# Altium project latticeDevBoard.PrjPcb
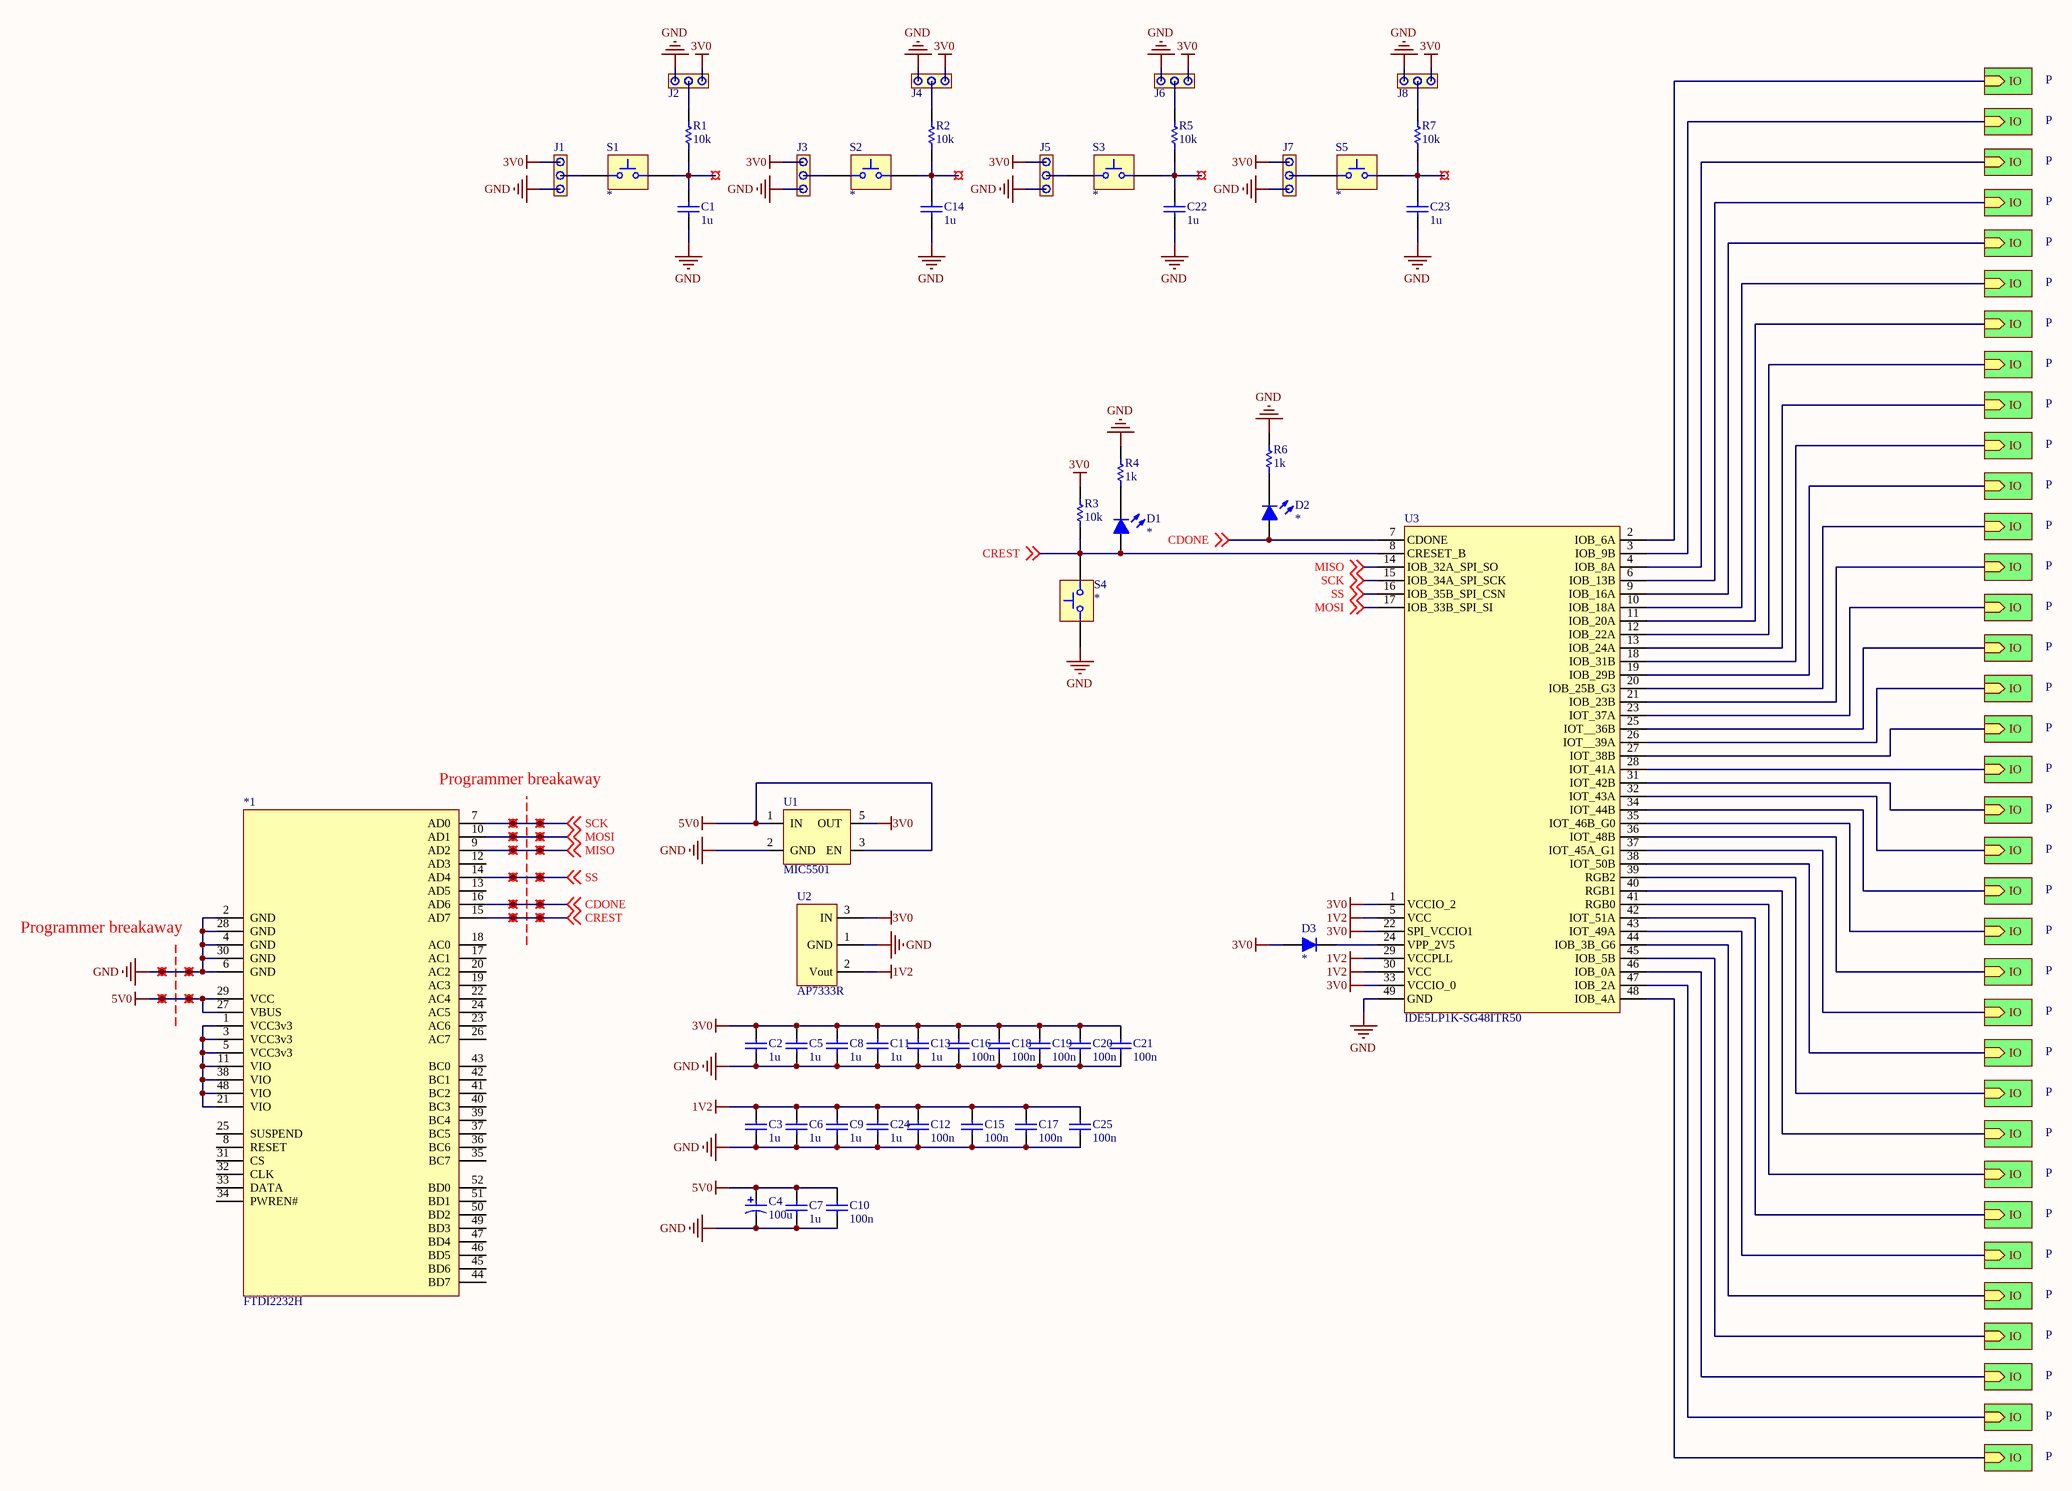
[diagram p0: Sheet1.SchDoc]
2 sheets, 283 parts. Net scope: hierarchical (ports join the sheet entries above them; power ports are global).
Board file: PCB1.PcbDoc
Sheets:
  Sheet1.SchDoc
    P = IOpin.SchDoc
    P = IOpin.SchDoc
    P = IOpin.SchDoc
    P = IOpin.SchDoc
    P = IOpin.SchDoc
    P = IOpin.SchDoc
    P = IOpin.SchDoc
    P = IOpin.SchDoc
    P = IOpin.SchDoc
    P = IOpin.SchDoc
    P = IOpin.SchDoc
    P = IOpin.SchDoc
    P = IOpin.SchDoc
    P = IOpin.SchDoc
    P = IOpin.SchDoc
    P = IOpin.SchDoc
    P = IOpin.SchDoc
    P = IOpin.SchDoc
    P = IOpin.SchDoc
    P = IOpin.SchDoc
    P = IOpin.SchDoc
    P = IOpin.SchDoc
    P = IOpin.SchDoc
    P = IOpin.SchDoc
    P = IOpin.SchDoc
    P = IOpin.SchDoc
    P = IOpin.SchDoc
    P = IOpin.SchDoc
    P = IOpin.SchDoc
    P = IOpin.SchDoc
    P = IOpin.SchDoc
    P = IOpin.SchDoc
    P = IOpin.SchDoc
    P = IOpin.SchDoc
    P = IOpin.SchDoc

## Sheet Sheet1.SchDoc
size A2

### Parts
*  Logo  [ALogo]  (value not drawn)
*1  FTDI2232H  [FTDI2232H]
C1  1u  [CAP 0805_N]
C2  1u  [CAP 0805_N]
C3  1u  [CAP 0805_N]
C4  100u  [SMD CAP-6.3X7.7MM-A1K2]
C5  1u  [CAP 0805_N]
C6  1u  [CAP 0805_N]
C7  1u  [CAP 0805_N]
C8  1u  [CAP 0805_N]
C9  1u  [CAP 0805_N]
C10  100n  [CAP 0603_N]
C11  1u  [CAP 0805_N]
C12  100n  [CAP 0603_N]
C13  1u  [CAP 0805_N]
C14  1u  [CAP 0805_N]
C15  100n  [CAP 0603_N]
C16  100n  [CAP 0603_N]
C17  100n  [CAP 0603_N]
C18  100n  [CAP 0603_N]
C19  100n  [CAP 0603_N]
C20  100n  [CAP 0603_N]
C21  100n  [CAP 0603_N]
C22  1u  [CAP 0805_N]
C23  1u  [CAP 0805_N]
C24  1u  [CAP 0805_N]
C25  100n  [CAP 0603_N]
D1  (no value)  [LED-0603-K1A2]
D2  (no value)  [LED-0603-K1A2]
D3  *  [SMA_L-K1A2]
J1  (no value)  [HDR1X3 VERT]
J2  (no value)  [HDR1X3 VERT]
J3  (no value)  [HDR1X3 VERT]
J4  (no value)  [HDR1X3 VERT]
J5  (no value)  [HDR1X3 VERT]
J6  (no value)  [HDR1X3 VERT]
J7  (no value)  [HDR1X3 VERT]
J8  (no value)  [HDR1X3 VERT]
R1  value 10k  [RES 0603_N]  (hidden comment: Res)
R2  value 10k  [RES 0603_N]  (hidden comment: Res)
R3  value 10k  [RES 0603_N]  (hidden comment: Res)
R4  value 1k  [RES 0603_N]  (hidden comment: Res)
R5  value 10k  [RES 0603_N]  (hidden comment: Res)
R6  value 1k  [RES 0603_N]  (hidden comment: Res)
R7  value 10k  [RES 0603_N]  (hidden comment: Res)
S1  SW Tactile  [SW-TACT-SMD-6035]  (value not drawn)
S2  SW Tactile  [SW-TACT-SMD-6035]  (value not drawn)
S3  SW Tactile  [SW-TACT-SMD-6035]  (value not drawn)
S4  SW Tactile  [SW-TACT-SMD-6035]  (value not drawn)
S5  SW Tactile  [SW-TACT-SMD-6035]  (value not drawn)
TP1  (no value)  [THTP]
TP2  (no value)  [THTP]
TP3  (no value)  [THTP]
TP4  (no value)  [THTP]
TP5  (no value)  [THTP]
TP6  (no value)  [THTP]
TP7  (no value)  [THTP]
TP8  (no value)  [THTP]
TP9  (no value)  [THTP]
TP10  (no value)  [THTP]
TP11  (no value)  [THTP]
TP12  (no value)  [THTP]
TP13  (no value)  [THTP]
TP14  (no value)  [THTP]
TP15  (no value)  [THTP]
TP16  (no value)  [THTP]
TP17  (no value)  [THTP]
TP26  (no value)  [THTP]
TP28  (no value)  [THTP]
TP30  (no value)  [THTP]
U1  MIC5501  [SOT23-5]
U2  AP7333R  [SOT95P245X110-3N]
U3  IDE5LP1K-SG48ITR50  [QFN50P700X700X85_HS-49M]

### Sub-sheets
P = IOpin.SchDoc: IO (in)
P = IOpin.SchDoc: IO (in)
P = IOpin.SchDoc: IO (in)
P = IOpin.SchDoc: IO (in)
P = IOpin.SchDoc: IO (in)
P = IOpin.SchDoc: IO (in)
P = IOpin.SchDoc: IO (in)
P = IOpin.SchDoc: IO (in)
P = IOpin.SchDoc: IO (in)
P = IOpin.SchDoc: IO (in)
P = IOpin.SchDoc: IO (in)
P = IOpin.SchDoc: IO (in)
P = IOpin.SchDoc: IO (in)
P = IOpin.SchDoc: IO (in)
P = IOpin.SchDoc: IO (in)
P = IOpin.SchDoc: IO (in)
P = IOpin.SchDoc: IO (in)
P = IOpin.SchDoc: IO (in)
P = IOpin.SchDoc: IO (in)
P = IOpin.SchDoc: IO (in)
P = IOpin.SchDoc: IO (in)
P = IOpin.SchDoc: IO (in)
P = IOpin.SchDoc: IO (in)
P = IOpin.SchDoc: IO (in)
P = IOpin.SchDoc: IO (in)
P = IOpin.SchDoc: IO (in)
P = IOpin.SchDoc: IO (in)
P = IOpin.SchDoc: IO (in)
P = IOpin.SchDoc: IO (in)
P = IOpin.SchDoc: IO (in)
P = IOpin.SchDoc: IO (in)
P = IOpin.SchDoc: IO (in)
P = IOpin.SchDoc: IO (in)
P = IOpin.SchDoc: IO (in)
P = IOpin.SchDoc: IO (in)

### Nets
1V2: C3.1 C6.1 C9.1 C12.1 C15.1 C17.1 C24.1 C25.1 U2.2(Vout) U3.5(VCC) U3.29(VCCPLL) U3.30(VCC)
3V0: C2.1 C5.1 C8.1 C11.1 C13.1 C16.1 C18.1 C19.1 C20.1 C21.1 D3.2(A) J1.3 J2.1 J3.3 J4.1 J5.3 J6.1 J7.3 J8.1 R3.2 U1.5(OUT) U2.3(IN) U3.1(VCCIO_2) U3.22(SPI_VCCIO1) U3.33(VCCIO_0)
5V0: *1.27(VBUS) *1.29(VCC) C4.1(A) C7.1 C10.1 TP2.1 TP4.1 U1.1(IN) U1.3(EN)
GND: *1.2(GND) *1.4(GND) *1.6(GND) *1.28(GND) *1.30(GND) C1.2 C2.2 C3.2 C4.2(K) C5.2 C6.2 C7.2 C8.2 C9.2 C10.2 C11.2 C12.2 C13.2 C14.2 C15.2 C16.2 C17.2 C18.2 C19.2 C20.2 C21.2 C22.2 C23.2 C24.2 C25.2 J1.1 J2.3 J3.1 J4.3 J5.1 J6.3 J7.1 J8.3 R4.1 R6.1 S4.1 TP1.1 TP3.1 U1.2(GND) U2.1(GND) U3.49(GND)
CDONE: *1.16(AD6) D2.2(A) TP9.1 TP15.1 U3.7(CDONE) ; off-sheet CDONE
CREST: *1.15(AD7) D1.2(A) R3.1 S4.2 TP10.1 TP16.1 U3.8(CRESET_B) ; off-sheet CREST
MISO: *1.9(AD2) TP7.1 TP13.1 U3.14(IOB_32A_SPI_SO) ; off-sheet MISO
MOSI: *1.10(AD1) TP6.1 TP12.1 U3.17(IOB_33B_SPI_SI) ; off-sheet MOSI
SCK: *1.7(AD0) TP5.1 TP11.1 U3.15(IOB_34A_SPI_SCK) ; off-sheet SCK
SS: *1.14(AD4) TP8.1 TP14.1 U3.16(IOB_35B_SPI_CSN) ; off-sheet SS
Net*1_1: *1.1(VCC3v3) *1.3(VCC3v3) *1.5(VCC3v3) *1.11(VIO) *1.21(VIO) *1.38(VIO) *1.48(VIO)
NetC1_1: C1.1 R1.1 S1.2 TP17.1
NetC14_1: C14.1 R2.1 S2.2 TP26.1
NetC22_1: C22.1 R5.1 S3.2 TP28.1
NetC23_1: C23.1 R7.1 S5.2 TP30.1
NetD1_1: D1.1(K) R4.2
NetD2_1: D2.1(K) R6.2
NetD3_1: D3.1(K) U3.24(VPP_2V5)
NetJ1_2: J1.2 S1.1
NetJ2_2: J2.2 R1.2
NetJ3_2: J3.2 S2.1
NetJ4_2: J4.2 R2.2
NetJ5_2: J5.2 S3.1
NetJ6_2: J6.2 R5.2
NetJ7_2: J7.2 S5.1
NetJ8_2: J8.2 R7.2
NetR8_P#1_1: U3.2(IOB_6A) ; sheet P/IO
NetR8_P#2_1: U3.3(IOB_9B) ; sheet P/IO
NetR8_P#3_1: U3.4(IOB_8A) ; sheet P/IO
NetR8_P#4_1: U3.6(IOB_13B) ; sheet P/IO
NetR8_P#5_1: U3.9(IOB_16A) ; sheet P/IO
NetR8_P#6_1: U3.10(IOB_18A) ; sheet P/IO
NetR8_P#7_1: U3.11(IOB_20A) ; sheet P/IO
NetR8_P#8_1: U3.12(IOB_22A) ; sheet P/IO
NetR8_P#9_1: U3.13(IOB_24A) ; sheet P/IO
NetR8_P#10_1: U3.18(IOB_31B) ; sheet P/IO
NetR8_P#11_1: U3.19(IOB_29B) ; sheet P/IO
NetR8_P#12_1: U3.20(IOB_25B_G3) ; sheet P/IO
NetR8_P#13_1: U3.21(IOB_23B) ; sheet P/IO
NetR8_P#14_1: U3.23(IOT_37A) ; sheet P/IO
NetR8_P#15_1: U3.25(IOT__36B) ; sheet P/IO
NetR8_P#16_1: U3.26(IOT__39A) ; sheet P/IO
NetR8_P#17_1: U3.27(IOT_38B) ; sheet P/IO
NetR8_P#18_1: U3.28(IOT_41A) ; sheet P/IO
NetR8_P#19_1: U3.31(IOT_42B) ; sheet P/IO
NetR8_P#20_1: U3.32(IOT_43A) ; sheet P/IO
NetR8_P#21_1: U3.34(IOT_44B) ; sheet P/IO
NetR8_P#22_1: U3.35(IOT_46B_G0) ; sheet P/IO
NetR8_P#23_1: U3.36(IOT_48B) ; sheet P/IO
NetR8_P#24_1: U3.37(IOT_45A_G1) ; sheet P/IO
NetR8_P#25_1: U3.38(IOT_50B) ; sheet P/IO
NetR8_P#26_1: U3.39(RGB2) ; sheet P/IO
NetR8_P#27_1: U3.40(RGB1) ; sheet P/IO
NetR8_P#28_1: U3.41(RGB0) ; sheet P/IO
NetR8_P#29_1: U3.42(IOT_51A) ; sheet P/IO
NetR8_P#30_1: U3.43(IOT_49A) ; sheet P/IO
NetR8_P#31_1: U3.44(IOB_3B_G6) ; sheet P/IO
NetR8_P#32_1: U3.45(IOB_5B) ; sheet P/IO
NetR8_P#33_1: U3.46(IOB_0A) ; sheet P/IO
NetR8_P#34_1: U3.47(IOB_2A) ; sheet P/IO
NetR8_P#35_1: U3.48(IOB_4A) ; sheet P/IO

Not connected (* = marked no-connect by the designer): *1 8(RESET) 12(AD3) 13(AD5) 17(AC1) 18(AC0) 19(AC3) 20(AC2) 22(AC4) 23(AC6) 24(AC5) 25(SUSPEND) 26(AC7) 31(CS) 32(CLK) 33(DATA) 34(PWREN#) 35(BC7) 36(BC6) 37(BC5) 39(BC4) 40(BC3) 41(BC2) 42(BC1) 43(BC0) 44(BD7) 45(BD6) 46(BD5) 47(BD4) 49(BD3) 50(BD2) 51(BD1) 52(BD0)

### Notes on the sheet
- Programmer breakaway
- Revision:
- Title:

### Library data of the parts
C1-C3 C5-C25 = -Cap Non-Pol: CAP, CER; Voltage: *
  C1-C3 C5-C9 C11 C13 C14 C22-C24: Value: 1u
  C10 C12 C15-C21 C25: Value: 100n
C4 = -Cap Aluminum: CAP, ALUM, A1K2; Voltage: *; ESR: *; Value: 100u
D1 D2 = -LED K1A2: 2 Pin LED K1A2; Label: *
D3 = -Diode K1A2: 2 Pin Diode K1A2; Value: *
J1-J8 = Header 1-3: Header, 3 Pin, 1.27mm Pitch, Vertical
R1-R7 = Res: Resistor; Published: 8-Jun-2000; LatestRevisionDate: 17-Jul-2002; LatestRevisionNote: Re-released for DXP Platform.; PackageReference: AXIAL-0.3; Publisher: Altium Limited; PackageDescription: Axial Device, Thru-Hole; 2 Leads; 0.3 in Pin Spacing
S1-S5 = SW-NO (PTS635SH43SMTRLFS): SPST, Normally Open, Push Button; Value: PTS635SH43SMTRLFS; Supplier 1: Mouser; Supplier Part Number 1: 611-PTS635SH43SMTRLF; Label: *
TP1-TP17 TP26 TP28 TP30 = THTP
U1 = LP5907: Value: *

## Sheet IOpin.SchDoc
size A
Used 35 times, as channels P, P, P, P, P, P, P, P, P, P, P, P, P, P, P, P, P, P, P, P, P, P, P, P, P, P, P, P, P, P, P, P, P, P, P. Parts and nets are listed once, with the designators drawn on the sheet.
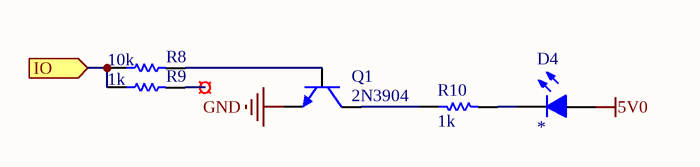
[diagram p1: IOpin.SchDoc]

### Parts
D4  (no value)  [LED-0603-K1A2]
Q1  2N3904  [SOT95P245X110-3N]
R8  value 10k  [RES 0603_N]  (hidden comment: Res)
R9  value 1k  [RES 0603_N]  (hidden comment: Res)
R10  value 1k  [RES 0603_N]  (hidden comment: Res)
TP31  (no value)  [THTP]

### Ports
IO (in)

### Nets
5V0: D4.2(A)
GND: Q1.2(E)
IO: R8.1 R9.1 ; port IO
NetD4_1: D4.1(K) R10.2
NetQ1_1: Q1.1(B) R8.2
NetQ1_3: Q1.3(C) R10.1
NetR9_2: R9.2 TP31.1

### Channels
P: designators end in _P#1; ports IO=NetR8_P#1_1
P: designators end in _P#2; ports IO=NetR8_P#2_1
P: designators end in _P#3; ports IO=NetR8_P#3_1
P: designators end in _P#4; ports IO=NetR8_P#4_1
P: designators end in _P#5; ports IO=NetR8_P#5_1
P: designators end in _P#6; ports IO=NetR8_P#6_1
P: designators end in _P#7; ports IO=NetR8_P#7_1
P: designators end in _P#8; ports IO=NetR8_P#8_1
P: designators end in _P#9; ports IO=NetR8_P#9_1
P: designators end in _P#10; ports IO=NetR8_P#10_1
P: designators end in _P#11; ports IO=NetR8_P#11_1
P: designators end in _P#12; ports IO=NetR8_P#12_1
P: designators end in _P#13; ports IO=NetR8_P#13_1
P: designators end in _P#14; ports IO=NetR8_P#14_1
P: designators end in _P#15; ports IO=NetR8_P#15_1
P: designators end in _P#16; ports IO=NetR8_P#16_1
P: designators end in _P#17; ports IO=NetR8_P#17_1
P: designators end in _P#18; ports IO=NetR8_P#18_1
P: designators end in _P#19; ports IO=NetR8_P#19_1
P: designators end in _P#20; ports IO=NetR8_P#20_1
P: designators end in _P#21; ports IO=NetR8_P#21_1
P: designators end in _P#22; ports IO=NetR8_P#22_1
P: designators end in _P#23; ports IO=NetR8_P#23_1
P: designators end in _P#24; ports IO=NetR8_P#24_1
P: designators end in _P#25; ports IO=NetR8_P#25_1
P: designators end in _P#26; ports IO=NetR8_P#26_1
P: designators end in _P#27; ports IO=NetR8_P#27_1
P: designators end in _P#28; ports IO=NetR8_P#28_1
P: designators end in _P#29; ports IO=NetR8_P#29_1
P: designators end in _P#30; ports IO=NetR8_P#30_1
P: designators end in _P#31; ports IO=NetR8_P#31_1
P: designators end in _P#32; ports IO=NetR8_P#32_1
P: designators end in _P#33; ports IO=NetR8_P#33_1
P: designators end in _P#34; ports IO=NetR8_P#34_1
P: designators end in _P#35; ports IO=NetR8_P#35_1

### Library data of the parts
D4 = -LED K1A2: 2 Pin LED K1A2; Label: *
Q1 = 2N3904: NPN General Purpose Amplifier; Published: 8-Jun-2000; LatestRevisionDate: 15-Jan-2003; LatestRevisionNote: PCB Footprint 'BCY-W3/D4.7' replaced; DatasheetVersion: 1997; PackageVersion: Sep-1998; PackageReference: TO-92A; Publisher: Altium Limited; PackageDescription: TO, Flat Index; 3 In-Line, Axial Leads; Body Dia. 4.5mm; Leads 0.51 x 0.48 mm (max); ComponentLink1Description: Manufacturer Link; ComponentLink1URL: http://www.fairchildsemi.com/; ComponentLink2Description: Datasheet; ComponentLink2URL: http://www.fairchildsemi.com/ds/2N%2F2N3904.pdf
R8-R10 = Res: Resistor; Published: 8-Jun-2000; LatestRevisionDate: 17-Jul-2002; LatestRevisionNote: Re-released for DXP Platform.; PackageReference: AXIAL-0.3; Publisher: Altium Limited; PackageDescription: Axial Device, Thru-Hole; 2 Leads; 0.3 in Pin Spacing
TP31 = THTP

## Nets that join several sheets
5V0: Sheet1 (9 pins), P (D4_P#1.2), P (D4_P#2.2), P (D4_P#3.2), P (D4_P#4.2), P (D4_P#5.2), P (D4_P#6.2), P (D4_P#7.2), P (D4_P#8.2), P (D4_P#9.2), P (D4_P#10.2), P (D4_P#11.2), P (D4_P#12.2), P (D4_P#13.2), P (D4_P#14.2), P (D4_P#15.2), P (D4_P#16.2), P (D4_P#17.2), P (D4_P#18.2), P (D4_P#19.2), P (D4_P#20.2), P (D4_P#21.2), P (D4_P#22.2), P (D4_P#23.2), P (D4_P#24.2), P (D4_P#25.2), P (D4_P#26.2), P (D4_P#27.2), P (D4_P#28.2), P (D4_P#29.2), P (D4_P#30.2), P (D4_P#31.2), P (D4_P#32.2), P (D4_P#33.2), P (D4_P#34.2), P (D4_P#35.2)
GND: Sheet1 (46 pins), P (Q1_P#1.2), P (Q1_P#2.2), P (Q1_P#3.2), P (Q1_P#4.2), P (Q1_P#5.2), P (Q1_P#6.2), P (Q1_P#7.2), P (Q1_P#8.2), P (Q1_P#9.2), P (Q1_P#10.2), P (Q1_P#11.2), P (Q1_P#12.2), P (Q1_P#13.2), P (Q1_P#14.2), P (Q1_P#15.2), P (Q1_P#16.2), P (Q1_P#17.2), P (Q1_P#18.2), P (Q1_P#19.2), P (Q1_P#20.2), P (Q1_P#21.2), P (Q1_P#22.2), P (Q1_P#23.2), P (Q1_P#24.2), P (Q1_P#25.2), P (Q1_P#26.2), P (Q1_P#27.2), P (Q1_P#28.2), P (Q1_P#29.2), P (Q1_P#30.2), P (Q1_P#31.2), P (Q1_P#32.2), P (Q1_P#33.2), P (Q1_P#34.2), P (Q1_P#35.2)
NetR8_P#1_1: Sheet1 (U3.2), P (R8_P#1.1 R9_P#1.1)
NetR8_P#2_1: Sheet1 (U3.3), P (R8_P#2.1 R9_P#2.1)
NetR8_P#3_1: Sheet1 (U3.4), P (R8_P#3.1 R9_P#3.1)
NetR8_P#4_1: Sheet1 (U3.6), P (R8_P#4.1 R9_P#4.1)
NetR8_P#5_1: Sheet1 (U3.9), P (R8_P#5.1 R9_P#5.1)
NetR8_P#6_1: Sheet1 (U3.10), P (R8_P#6.1 R9_P#6.1)
NetR8_P#7_1: Sheet1 (U3.11), P (R8_P#7.1 R9_P#7.1)
NetR8_P#8_1: Sheet1 (U3.12), P (R8_P#8.1 R9_P#8.1)
NetR8_P#9_1: Sheet1 (U3.13), P (R8_P#9.1 R9_P#9.1)
NetR8_P#10_1: Sheet1 (U3.18), P (R8_P#10.1 R9_P#10.1)
NetR8_P#11_1: Sheet1 (U3.19), P (R8_P#11.1 R9_P#11.1)
NetR8_P#12_1: Sheet1 (U3.20), P (R8_P#12.1 R9_P#12.1)
NetR8_P#13_1: Sheet1 (U3.21), P (R8_P#13.1 R9_P#13.1)
NetR8_P#14_1: Sheet1 (U3.23), P (R8_P#14.1 R9_P#14.1)
NetR8_P#15_1: Sheet1 (U3.25), P (R8_P#15.1 R9_P#15.1)
NetR8_P#16_1: Sheet1 (U3.26), P (R8_P#16.1 R9_P#16.1)
NetR8_P#17_1: Sheet1 (U3.27), P (R8_P#17.1 R9_P#17.1)
NetR8_P#18_1: Sheet1 (U3.28), P (R8_P#18.1 R9_P#18.1)
NetR8_P#19_1: Sheet1 (U3.31), P (R8_P#19.1 R9_P#19.1)
NetR8_P#20_1: Sheet1 (U3.32), P (R8_P#20.1 R9_P#20.1)
NetR8_P#21_1: Sheet1 (U3.34), P (R8_P#21.1 R9_P#21.1)
NetR8_P#22_1: Sheet1 (U3.35), P (R8_P#22.1 R9_P#22.1)
NetR8_P#23_1: Sheet1 (U3.36), P (R8_P#23.1 R9_P#23.1)
NetR8_P#24_1: Sheet1 (U3.37), P (R8_P#24.1 R9_P#24.1)
NetR8_P#25_1: Sheet1 (U3.38), P (R8_P#25.1 R9_P#25.1)
NetR8_P#26_1: Sheet1 (U3.39), P (R8_P#26.1 R9_P#26.1)
NetR8_P#27_1: Sheet1 (U3.40), P (R8_P#27.1 R9_P#27.1)
NetR8_P#28_1: Sheet1 (U3.41), P (R8_P#28.1 R9_P#28.1)
NetR8_P#29_1: Sheet1 (U3.42), P (R8_P#29.1 R9_P#29.1)
NetR8_P#30_1: Sheet1 (U3.43), P (R8_P#30.1 R9_P#30.1)
NetR8_P#31_1: Sheet1 (U3.44), P (R8_P#31.1 R9_P#31.1)
NetR8_P#32_1: Sheet1 (U3.45), P (R8_P#32.1 R9_P#32.1)
NetR8_P#33_1: Sheet1 (U3.46), P (R8_P#33.1 R9_P#33.1)
NetR8_P#34_1: Sheet1 (U3.47), P (R8_P#34.1 R9_P#34.1)
NetR8_P#35_1: Sheet1 (U3.48), P (R8_P#35.1 R9_P#35.1)